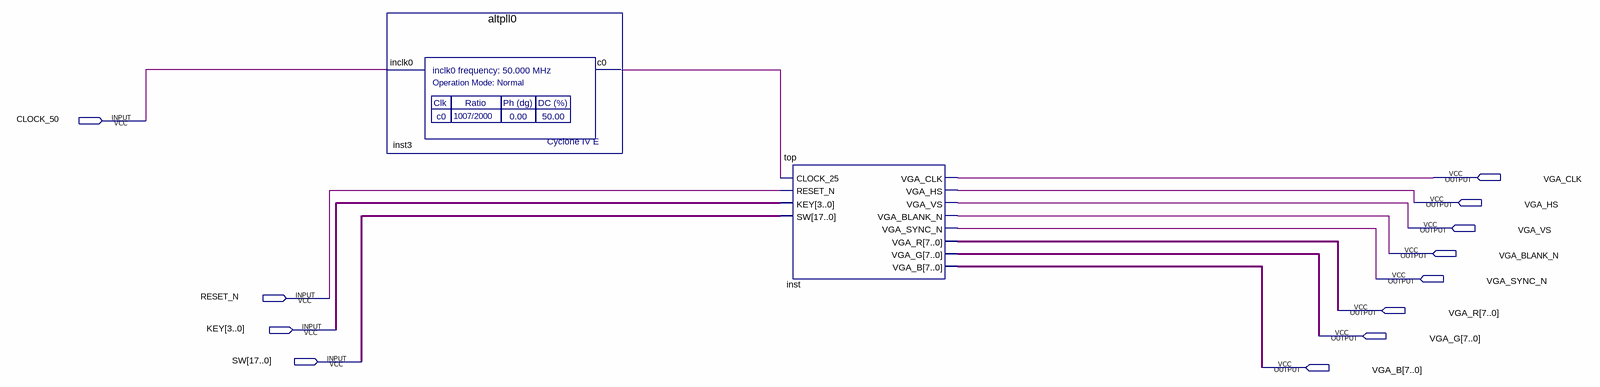
[diagram p0: schematic sheet]
// Quartus schematic TopLevel.bdf as structural Verilog: 2 symbols, 12 pins
module TopLevel (
  input  CLOCK_50,
  input  RESET_N,
  input  [3:0] KEY,
  input  [17:0] SW,
  output VGA_CLK,
  output VGA_HS,
  output VGA_VS,
  output VGA_BLANK_N,
  output VGA_SYNC_N,
  output [7:0] VGA_R,
  output [7:0] VGA_G,
  output [7:0] VGA_B
);

  wire inst3_c0;

  altpll0 inst3 (.inclk0(CLOCK_50), .c0(inst3_c0));
  top inst (
    .CLOCK_25(inst3_c0), .RESET_N(RESET_N), .KEY(KEY), .SW(SW), .VGA_CLK(VGA_CLK), .VGA_HS(VGA_HS),
    .VGA_VS(VGA_VS), .VGA_BLANK_N(VGA_BLANK_N), .VGA_SYNC_N(VGA_SYNC_N), .VGA_R(VGA_R), .VGA_G(VGA_G),
    .VGA_B(VGA_B));
endmodule
